# EAGLE design untitled (EAGLE 7.6.0)
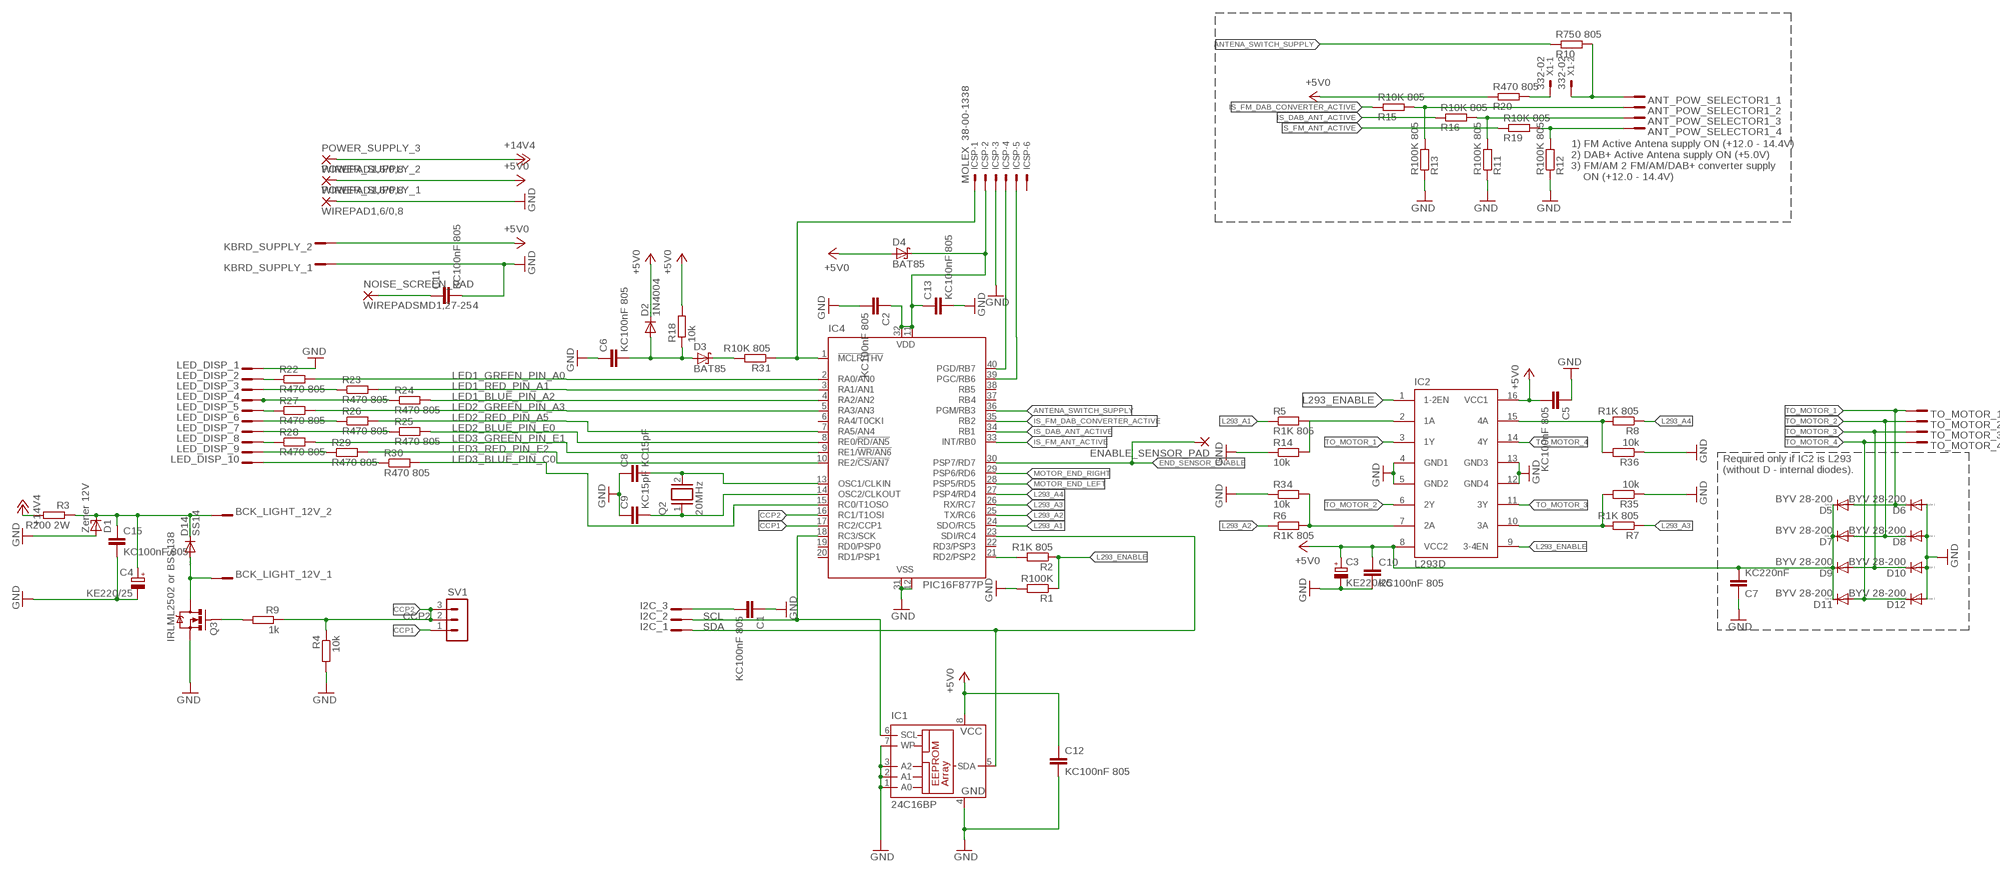
[diagram p0: schematic, sheet 1, part 1 of 2]
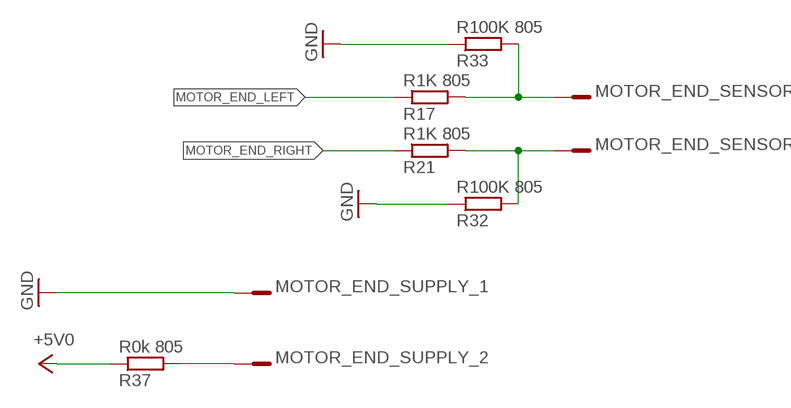
[diagram p1: schematic, sheet 1, part 2 of 2]

## Parts
ANT_POW_SELECTOR1  JST_4_PIN_B4B-PH-KS  [B4B-PH-KS]
BCK_LIGHT_12V  JST_2_PIN_B2B-XH-A  [B2B-XH-A]
C1  KC100nF 805  C-EUC0805  [C0805]
C2  KC100nF 805  C-EUC0805  [C0805]
C3  KE220/25  CPOL-EUE3.5-8  [E3,5-8]
C4  KE220/25  CPOL-EUTT2D7  [TT2D7]
C5  KC100nF 805  C-EUC0805  [C0805]
C6  KC100nF 805  C-EUC0805  [C0805]
C7  KC220nF  C-EU050-030X075  [C050-030X075]
C8  KC15pF  C-EU025-030X050  [C025-030X050]
C9  KC15pF  C-EU025-030X050  [C025-030X050]
C10  KC100nF 805  C-EUC0805  [C0805]
C11  KC100nF 805  C-EUC0805  [C0805]
C12  KC100nF 805  C-EUC0805  [C0805]
C13  KC100nF 805  C-EUC0805  [C0805]
C15  KC100nF 805  C-EUC0805  [C0805]
D1  Zener 12V  ZENER-DIODEZD-5  [ZDIO-5]
D2  1N4004  1N4004DO41-7.6  [DO41-7.6]
D3  BAT85  BAT85DO34-5  [DO34-5]
D4  BAT85  BAT85DO34-5  [DO34-5]
D5  BYV 28-200  BYV28  [SOD64-10]
D6  BYV 28-200  BYV28  [SOD64-10]
D7  BYV 28-200  BYV28  [SOD64-10]
D8  BYV 28-200  BYV28  [SOD64-10]
D9  BYV 28-200  BYV28  [SOD64-10]
D10  BYV 28-200  BYV28  [SOD64-10]
D11  BYV 28-200  BYV28  [SOD64-10]
D12  BYV 28-200  BYV28  [SOD64-10]
D14  SS14  DIODE-SMB  [SMB]
ENABLE_SENSOR_PAD  SMD2  [SMD1,27-2,54]
I2C  JST_3_PIN_B3B-PH-KS  [B3B-PH-KS]
IC1  24C16BP  [DIL8]
IC2  L293D  [DIL16]
IC4  PIC16F877P  [DIL40]
ICSP  MOLEX 38-00-1338  22-27-2061-06  [6410-06]
KBRD_SUPPLY  JST_2_PIN_B2B-PH-KS  [B2B-PH-KS]
LED_DISP  JST_10_PIN_B10B-PH-KS  [B10B-PH-KS]
MOTOR_END_SENSOR  JST_2_PIN_B2B-PH-KS  [B2B-PH-KS]
MOTOR_END_SUPPLY  JST_2_PIN_B2B-PH-KS  [B2B-PH-KS]
NOISE_SCREEN_PAD  WIREPADSMD1,27-254  [SMD1,27-2,54]
POWER_SUPPLY_1  WIREPAD1,6/0,8  [1,6/0,8]
POWER_SUPPLY_2  WIREPAD1,6/0,8  [1,6/0,8]
POWER_SUPPLY_3  WIREPAD1,6/0,8  [1,6/0,8]
Q2  20MHz  XTAL/S  [QS]
Q3  IRLML2502 or BSS138  MOSFET-NCHANNELSMD  [SOT23-3]
R1  R100K  R-EU_0204/7  [0204/7]
R2  R1K 805  R-EU_R0805  [R0805]
R3  R200 2W  R-EU_0207/12  [0207/12]
R4  10k  R-EU_M0805  [M0805]
R5  R1K 805  R-EU_R0805  [R0805]
R6  R1K 805  R-EU_R0805  [R0805]
R7  R1K 805  R-EU_R0805  [R0805]
R8  R1K 805  R-EU_R0805  [R0805]
R9  1k  R-EU_0207/12  [0207/12]
R10  R750 805  R-EU_R0805  [R0805]
R11  R100K 805  R-EU_R0805  [R0805]
R12  R100K 805  R-EU_R0805  [R0805]
R13  R100K 805  R-EU_R0805  [R0805]
R14  10k  R-EU_0204/2V  [0204V]
R15  R10K 805  R-EU_R0805  [R0805]
R16  R10K 805  R-EU_R0805  [R0805]
R17  R1K 805  R-EU_R0805  [R0805]
R18  10k  R-EU_R0805  [R0805]
R19  R10K 805  R-EU_R0805  [R0805]
R20  R470 805  R-EU_R0805  [R0805]
R21  R1K 805  R-EU_R0805  [R0805]
R22  R470 805  R-EU_R0805  [R0805]
R23  R470 805  R-EU_R0805  [R0805]
R24  R470 805  R-EU_R0805  [R0805]
R25  R470 805  R-EU_R0805  [R0805]
R26  R470 805  R-EU_R0805  [R0805]
R27  R470 805  R-EU_R0805  [R0805]
R28  R470 805  R-EU_R0805  [R0805]
R29  R470 805  R-EU_R0805  [R0805]
R30  R470 805  R-EU_R0805  [R0805]
R31  R10K 805  R-EU_R0805  [R0805]
R32  R100K 805  R-EU_R0805  [R0805]
R33  R100K 805  R-EU_R0805  [R0805]
R34  10k  R-EU_0204/5  [0204/5]
R35  10k  R-EU_0204/7  [0204/7]
R36  10k  R-EU_0204/7  [0204/7]
R37  R0k 805  R-EU_R0805  [R0805]
SV1  MA03-1  [MA03-1]
TO_MOTOR  JST_4_PIN_B4B-XH-A  [B4B-XH-A]
X1  332-02  [332-02]

## Nets
+5V: C3.+ C5.2 C7.2 C10.1 C12.1 D2.C D4.A D5.C D7.C D9.C D11.C IC1.8(VCC) IC2.8(VCC2) IC2.16(VCC1) KBRD_SUPPLY.P$2 POWER_SUPPLY_2.1(P) R18.2 R20.1 R37.1 ; supply symbol labelled +5V0
+14V4: POWER_SUPPLY_3.1(P) R3.2
ANTENA_SWITCH_SUPPLY: IC4.36(PGM/RB3) R10.1
CCP1: IC4.17(RC2/CCP1) SV1.1
CCP2: IC4.16(RC1/T1OSI) R4.1 R9.1 SV1.2 SV1.3
END_SENSOR_ENABLE: ENABLE_SENSOR_PAD.1(P) IC4.30(PSP7/RD7)
GND: C1.1 C2.2 C3.- C4.- C5.1 C6.1 C7.1 C8.1 C9.1 C10.2 C11.2 C12.2 C13.2 C15.2 D1.A D6.A D8.A D10.A D12.A IC1.1(A0) IC1.2(A1) IC1.3(A2) IC1.4(GND) IC1.7(WP) IC2.4(GND1) IC2.5(GND2) IC2.12(GND4) IC2.13(GND3) IC4.12(VSS) IC4.31(VSS) ICSP.3 KBRD_SUPPLY.P$1 LED_DISP.P$1 MOTOR_END_SUPPLY.P$1 POWER_SUPPLY_1.1(P) Q3.2(S) R1.2 R4.2 R11.1 R12.1 R13.1 R14.1 R32.1 R33.1 R34.1 R35.1 R36.1
IS_DAB_ANT_ACTIVE: IC4.34(RB1) R16.1
IS_FM_ANT_ACTIVE: IC4.33(INT/RB0) R19.1
IS_FM_DAB_CONVERTER_ACTIVE: IC4.35(RB2) R15.1
L293_A1: IC4.24(SDO/RC5) R5.1
L293_A2: IC4.25(TX/RC6) R6.1
L293_A3: IC4.26(RX/RC7) R7.1
L293_A4: IC4.27(PSP4/RD4) R8.1
L293_ENABLE: IC2.1(1-2EN) IC2.9(3-4EN) R1.1 R2.1
LED1_BLUE_PIN_A2: IC4.4(RA2/AN2) R24.2
LED1_GREEN: LED_DISP.P$3 R23.1
LED1_GREEN_PIN_A0: IC4.2(RA0/AN0) R22.2
LED1_RED: LED_DISP.P$4 R24.1
LED1_RED_PIN_A1: IC4.3(RA1/AN1) R23.2
LED2_BLUE: LED_DISP.P$5 R27.1
LED2_BLUE_PIN_E0: IC4.8(RE0/!RD/AN5) R25.2
LED2_GREEN: LED_DISP.P$6 R26.1
LED2_GREEN_PIN_A3: IC4.5(RA3/AN3) R27.2
LED2_RED: LED_DISP.P$7 R25.1
LED2_RED_PIN_A5: IC4.7(RA5/AN4) R26.2
LED3_BLUE: LED_DISP.P$8 R28.1
LED3_BLUE_PIN_C0: IC4.15(RC0/T1OSO) R30.2
LED3_GREEN: LED_DISP.P$9 R29.1
LED3_GREEN_PIN_E1: IC4.9(RE1/!WR/AN6) R28.2
LED3_RED: LED_DISP.P$10 R30.1
LED3_RED_PIN_E2: IC4.10(RE2/!CS/AN7) R29.2
MOTOR_END_LEFT: IC4.28(PSP5/RD5) R17.1
MOTOR_END_RIGHT: IC4.29(PSP6/RD6) R21.1
N$1: MOTOR_END_SUPPLY.P$2 R37.2
N$2: Q3.1(G) R9.2
N$3: BCK_LIGHT_12V.P$1 D14.A Q3.3(D)
N$4: R20.2 X1.1
N$5: IC2.2(1A) R5.2 R14.2
N$6: IC2.7(2A) R6.2 R34.2
N$8: IC2.15(4A) R8.2 R36.2
N$9: C8.2 IC4.13(OSC1/CLKIN) Q2.2
N$12: C1.2 I2C.P$3
N$14: MOTOR_END_SENSOR.P$2 R17.2 R33.2
N$15: MOTOR_END_SENSOR.P$1 R21.2 R32.2
N$22: C9.2 IC4.14(OSC2/CLKOUT) Q2.1
N$23: BCK_LIGHT_12V.P$2 C4.+ C15.1 D1.C D14.C R3.1
N$28: IC2.10(3A) R7.2 R35.2
N$32: ANT_POW_SELECTOR1.P$1 R10.2 X1.2
N$33: IC4.21(RD2/PSP2) R2.2
N$37: LED_DISP.P$2 R22.1
N$41: C2.1 C13.1 D4.C IC4.11(VDD) IC4.32(VDD) ICSP.2
N$49: C6.2 D2.A D3.A R18.1
N$53: D3.C R31.2
N$56: IC4.1(!MCLR/THV) ICSP.1 R31.1
NOISE_SCREEN: C11.1 NOISE_SCREEN_PAD.1(P)
PGC: IC4.39(PGC/RB6) ICSP.5
PGD: IC4.40(PGD/RB7) ICSP.4
SCL: I2C.P$2 IC1.6(SCL) IC4.18(RC3/SCK)
SDA: I2C.P$1 IC1.5(SDA) IC4.23(SDI/RC4)
SWITCH_1: ANT_POW_SELECTOR1.P$4 R12.2 R19.2
SWITCH_2: ANT_POW_SELECTOR1.P$3 R11.2 R16.2
SWITCH_3: ANT_POW_SELECTOR1.P$2 R13.2 R15.2
TO_MOTOR_1: D5.A D6.C IC2.3(1Y) TO_MOTOR.P$1
TO_MOTOR_2: D7.A D8.C IC2.6(2Y) TO_MOTOR.P$2
TO_MOTOR_3: D9.A D10.C IC2.11(3Y) TO_MOTOR.P$3
TO_MOTOR_4: D11.A D12.C IC2.14(4Y) TO_MOTOR.P$4
Unconnected: IC4.6(RA4/T0CKI) IC4.19(RD0/PSP0) IC4.20(RD1/PSP1) IC4.22(RD3/PSP3) IC4.37(RB4) IC4.38(RB5) ICSP.6

## Notes on the sheet
- 1) FM Active Antena supply ON (+12.0 - 14.4V)
  2) DAB+ Active Antena supply ON (+5.0V)
  3) FM/AM 2 FM/AM/DAB+ converter supply
      ON (+12.0 - 14.4V)
- Required only if IC2 is L293
  (without D - internal diodes).

## Library data of the parts
ANT_POW_SELECTOR1 TO_MOTOR = conn-JST:JST_4_PIN_
BCK_LIGHT_12V KBRD_SUPPLY MOTOR_END_SENSOR MOTOR_END_SUPPLY = conn-JST:JST_2_PIN_
C1 C2 C5-C13 C15 = rcl:C-EU: CAPACITOR, European symbol
C3 C4 = rcl:CPOL-EU: POLARIZED CAPACITOR, European symbol
D1 = diode:ZENER-DIODE: Z-Diode
D2 = diode_SileliS:1N4004: DIODE general purpose rectifier, 1 A
D3 D4 = diode_SileliS:BAT85
D5-D12 = diode:BYV28: DIODE ultra fast
D14 = diode:DIODE-: DIODE
ENABLE_SENSOR_PAD = wirepad:SMD2: SMD PAD
I2C = conn-JST:JST_3_PIN_
IC1 = microchip:24*: Serial EEPROM I2C; MPN: AT24C16B-PU; OC_FARNELL: 1362650; OC_NEWARK: 50M3323
IC2 = st-microelectronics:L293D: PUSH-PULL 4 CHANNEL DRIVER; MPN: L293D; OC_FARNELL: 9589619; OC_NEWARK: 56P8249
IC4 = microchip:PIC16F87*: MICROCONTROLLER; MF: MICROCHIP; MPN: PIC16F877-04/P; OC_FARNELL: 9761349; OC_NEWARK: 61K3463
ICSP = con-molex:22-?-06: CONNECTOR wire to board 2.54 mm (.1 inch) pitch header; OC_FARNELL: unknown; OC_NEWARK: unknown
LED_DISP = conn-JST:JST_10_PIN_
NOISE_SCREEN_PAD POWER_SUPPLY_1-POWER_SUPPLY_3 = wirepad:WIREPAD: Wire PAD connect wire on PCB
Q2 = special:XTAL/S: CRYSTAL
Q3 = SparkFun:MOSFET-NCHANNEL
R1 R2 R5-R8 R10-R37 = resistor:R-EU_: RESISTOR, European symbol
R3 R4 R9 = rcl:R-EU_: RESISTOR, European symbol
SV1 = con-lstb:MA03-1: PIN HEADER; OC_FARNELL: unknown; OC_NEWARK: unknown
X1 = con-garry:332-02: 2 Pin - 2mm Dual Row Source: www.mpe-connector.de / garry_shortform_2012.pdf

## Net classes
1 VCC: width 0.6 mm, clearance 0.6 mm

## Board
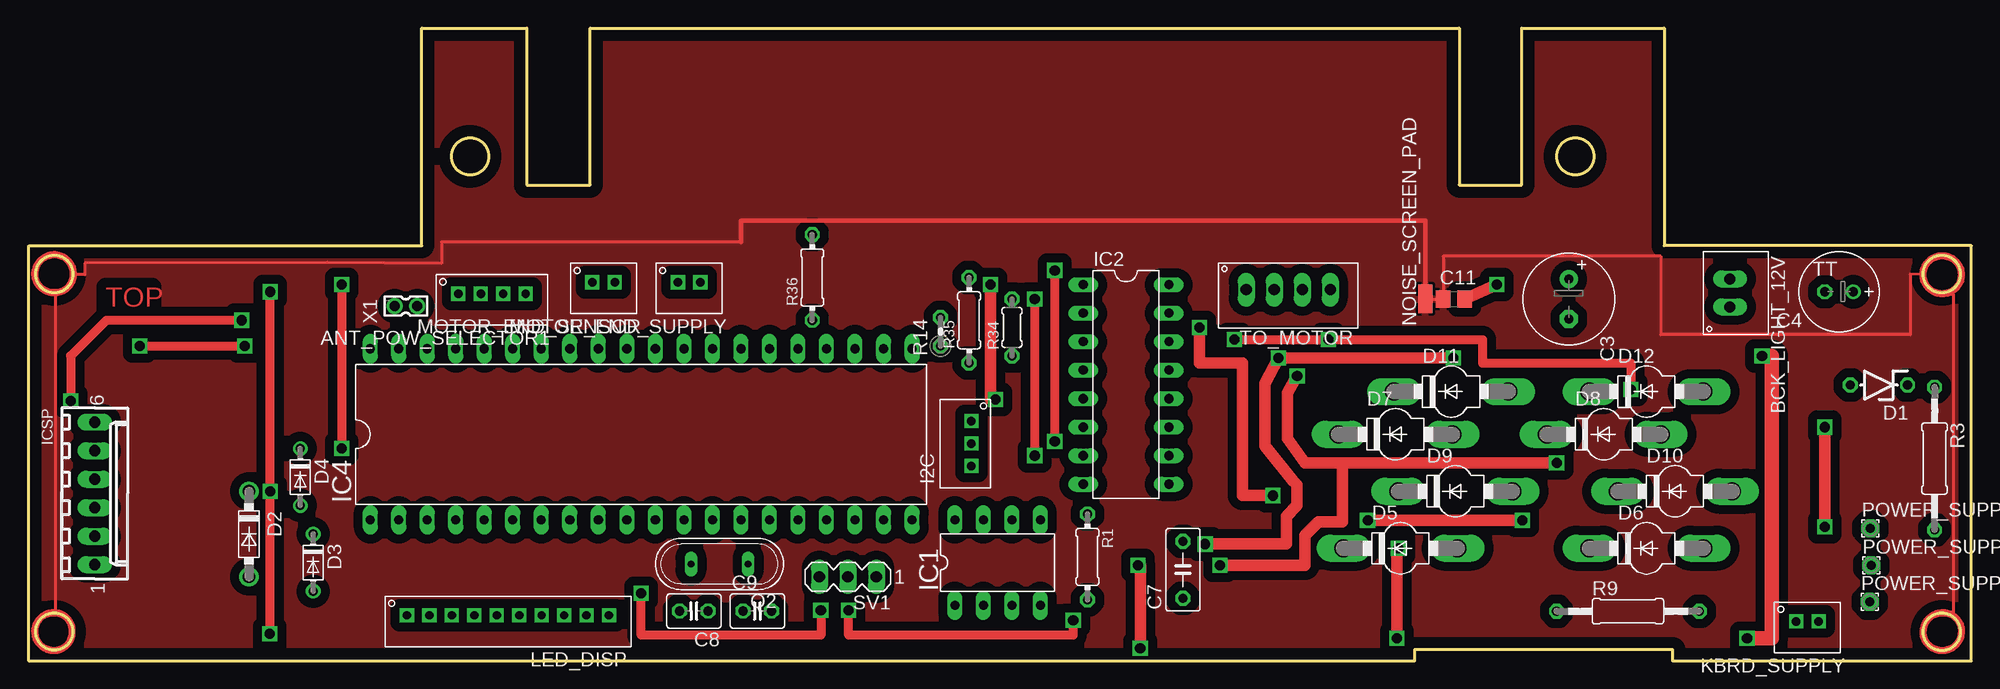
[diagram p2: board, top side]
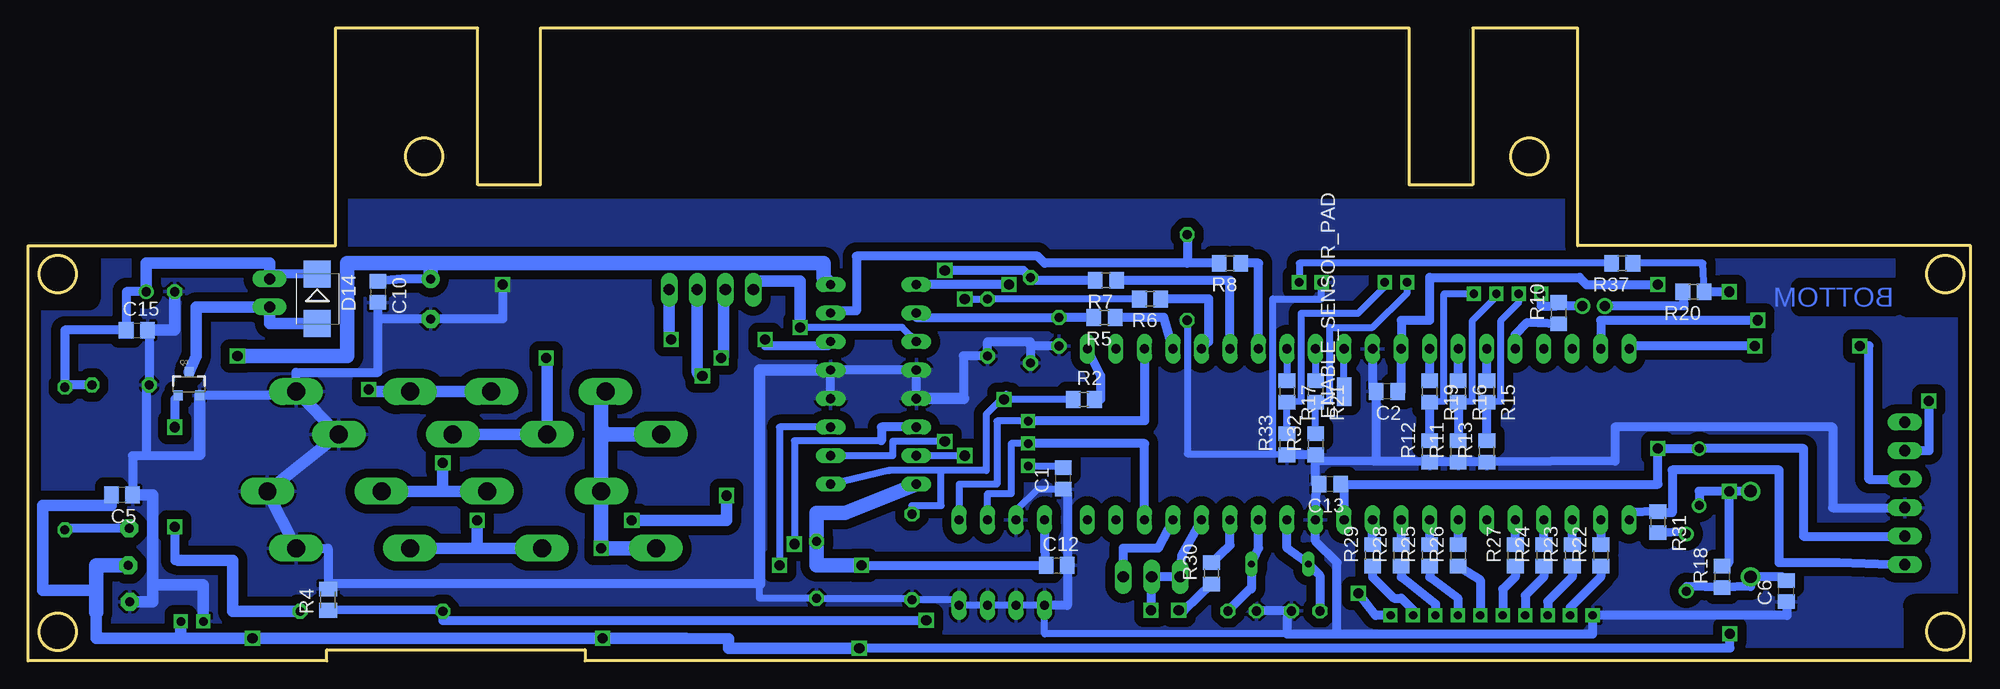
[diagram p3: board, bottom side, seen from below]

Size 173 x 56.38 mm. Coordinates in mm from the lower left corner, seen from the top.
Outline: 0,0 0,37 35,37 35,56.38 44.35,56.38 44.35,42.39 50,42.39 50,56.38 127.38,56.38 127.38,42.39 132.95,42.39 132.95,56.38 145.65,56.38 145.65,37 173,37 173,0 146.4,0 146.4,1 123.4,1 123.4,0 0,0
Outline: circle at 39.29,44.95 radius 1.65
Outline: circle at 137.72,44.95 radius 1.65
Outline: circle at 170.38,34.47 radius 1.65
Outline: circle at 170.38,2.6 radius 1.65
Outline: circle at 2.26,2.61 radius 1.65
Outline: circle at 2.26,34.47 radius 1.65
Copper layers (1*16): Top 0.035mm / dielectric 1.5mm / Bottom 0.035mm
Design rules "default": minimum track width 10mil, minimum drill 24mil, track to track 8mil, track to pad 8mil, pad to pad 8mil, via to via 8mil, smd to smd 8mil, copper to edge 40mil, drill to drill 8mil, minimum pad ring 10mil, minimum via ring 8mil, stop-mask expansion 4mil, vias tented up to drill 0mil, thermal gap 10mil
bRestrict: 16 lines

### Footprints (pad centres in the part's own frame; a part is rotated, then mirrored left to right if it is on the bottom)
B4B-PH-KS = drill 0.75 pad 1.2 square: P$1 -2,1.7; P$2 -4,1.7; P$3 -6,1.7; P$4 -8,1.7
B2B-XH-A = drill 1 long: P$1 -2.45,2.35; P$2 -4.95,2.35
C0805 = smd 1.3 x 1.5: 1 -0.95,0; 2 0.95,0
E3,5-8 = drill 0.813 pad 1.6: + -1.778,0 | drill 0.813 pad 1.6 octagon: - 1.778,0
TT2D7 = drill 0.813: + -1.27,0 | drill 0.813 octagon: - 1.27,0
C050-030X075 = drill 0.813 octagon: 1 -2.54,0; 2 2.54,0
C025-030X050 = drill 0.813 octagon: 1 -1.27,0; 2 1.27,0
ZDIO-5 = drill 0.813 octagon: A 2.54,0; C -2.54,0
DO41-7.6 = drill 1.1 pad 1.7: A 3.81,0; C -3.81,0
DO34-5 = drill 0.8: A 2.54,0; C -2.54,0
SOD64-10 = drill 1.6 long: A 5.08,0; C -5.08,0
SMB = smd 2.4 x 2.4: A 2.2,0; C -2.2,0
SMD1,27-2,54 = smd 1.27 x 2.54: 1 0,0
B3B-PH-KS = drill 0.75 pad 1.2 square: P$1 -2,1.7; P$2 -4,1.7; P$3 -6,1.7
DIL8 = drill 0.813 long: 1 -3.81,-3.81; 2 -1.27,-3.81; 3 1.27,-3.81; 4 3.81,-3.81; 5 3.81,3.81; 6 1.27,3.81; 7 -1.27,3.81; 8 -3.81,3.81
DIL16 = drill 0.813 long: 1 -8.89,-3.81; 2 -6.35,-3.81; 3 -3.81,-3.81; 4 -1.27,-3.81; 5 1.27,-3.81; 6 3.81,-3.81; 7 6.35,-3.81; 8 8.89,-3.81; 9 8.89,3.81; 10 6.35,3.81; 11 3.81,3.81; 12 1.27,3.81; 13 -1.27,3.81; 14 -3.81,3.81; 15 -6.35,3.81; 16 -8.89,3.81
DIL40 = drill 0.813 long: 1 -24.13,-7.62; 2 -21.59,-7.62; 3 -19.05,-7.62; 4 -16.51,-7.62; 5 -13.97,-7.62; 6 -11.43,-7.62; 7 -8.89,-7.62; 8 -6.35,-7.62; 9 -3.81,-7.62; 10 -1.27,-7.62; 11 1.27,-7.62; 12 3.81,-7.62; 13 6.35,-7.62; 14 8.89,-7.62; 15 11.43,-7.62; 16 13.97,-7.62; 17 16.51,-7.62; 18 19.05,-7.62; 19 21.59,-7.62; 20 24.13,-7.62; 21 24.13,7.62; 22 21.59,7.62; 23 19.05,7.62; 24 16.51,7.62; 25 13.97,7.62; 26 11.43,7.62; 27 8.89,7.62; 28 6.35,7.62; 29 3.81,7.62; 30 1.27,7.62; 31 -1.27,7.62; 32 -3.81,7.62; 33 -6.35,7.62; 34 -8.89,7.62; 35 -11.43,7.62; 36 -13.97,7.62; 37 -16.51,7.62; 38 -19.05,7.62; 39 -21.59,7.62; 40 -24.13,7.62
6410-06 = drill 1.016 long: 1 6.35,0; 2 3.81,0; 3 1.27,0; 4 -1.27,0; 5 -3.81,0; 6 -6.35,0
B2B-PH-KS = drill 0.75 pad 1.2 square: P$1 -2,1.7; P$2 -4,1.7
B10B-PH-KS = drill 0.75 pad 1.2 square: P$1 -2,1.7; P$2 -4,1.7; P$3 -6,1.7; P$4 -8,1.7; P$5 -10,1.7; P$6 -12,1.7; P$7 -14,1.7; P$8 -16,1.7; P$9 -18,1.7; P$10 -20,1.7
1,6/0,8 = drill 0.813 pad 1.6 octagon: 1 0,0
QS = drill 0.61 long: 1 -2.54,0; 2 2.54,0
SOT23-3 = smd 0.8 x 0.9: 1 -0.95,-1; 2 0.95,-1; 3 0,1.1
0204/7 = drill 0.813 octagon: 1 -3.81,0; 2 3.81,0
R0805 = smd 1.3 x 1.5: 1 -0.95,0; 2 0.95,0
0207/12 = drill 0.813 octagon: 1 -6.35,0; 2 6.35,0
M0805 = smd 1.3 x 1.6: 1 -0.95,0; 2 0.95,0
0204V = drill 0.813 octagon: 1 -1.27,0; 2 1.27,0
0204/5 = drill 0.813 octagon: 1 -2.54,0; 2 2.54,0
MA03-1 = drill 1.016 long: 1 -2.54,0; 2 0,0; 3 2.54,0
B4B-XH-A = drill 1 long: P$1 -2.45,2.35; P$2 -4.95,2.35; P$3 -7.45,2.35; P$4 -9.95,2.35
332-02 = drill 0.9 pad 1.27: 1 0,-1; 2 0,1

### Placement (x,y rotation side)
ANT_POW_SELECTOR1  36.24,34.41 180 top
BCK_LIGHT_12V  149.15,29.07 270 top
C1  80.82,16.25 90 bottom
C2  51.99,24 180 bottom
C3  137.14,32.25 270 top
C4  161.21,32.88 180 top
C5  164.64,14.79 180 bottom
C6  16.43,6.21 90 bottom
C7  102.79,8.12 90 top
C8  59.23,4.44 180 top
C9  64.88,4.44 0 top
C10  141.84,32.88 270 bottom
C11  126.92,32.25 0 top
C12  81.39,8.5 0 bottom
C13  57.07,15.74 180 bottom
C15  163.31,29.46 0 bottom
D1  164.77,24.57 180 top
D2  19.61,11.29 270 top
D3  25.32,8.76 270 top
D4  24.18,16.38 270 top
D5  122.16,10.03 0 top
D6  144.06,10.03 0 top
D7  121.71,20.18 0 top
D8  140.25,20.18 0 top
D9  127.05,15.11 0 top
D10  146.6,15.11 0 top
D11  126.67,24 0 top
D12  144.06,24 0 top
D14  147.24,32.25 270 bottom
ENABLE_SENSOR_PAD  55.8,24 0 bottom
I2C  85.64,23.36 90 top
IC1  86.28,8.76 0 top
IC2  97.71,24.63 270 top
IC4  54.53,20.18 0 top
ICSP  5.87,14.91 270 top
KBRD_SUPPLY  155.39,5.21 180 top
LED_DISP  31.67,5.76 180 top
MOTOR_END_SENSOR  48.18,35.42 180 top
MOTOR_END_SUPPLY  55.8,35.42 180 top
NOISE_SCREEN_PAD  124.38,32.25 0 top
POWER_SUPPLY_1  163.94,5.26 0 top
POWER_SUPPLY_2  164.07,8.5 0 top
POWER_SUPPLY_3  164,11.8 0 top
Q2  61.52,8.63 180 top
Q3  158.67,24.63 0 bottom
R1  94.28,9.26 270 top
R2  78.98,23.3 0 bottom
R3  169.72,18.03 270 top
R4  146.29,5.45 90 bottom
R5  77.14,30.6 180 bottom
R6  73.07,32.25 180 bottom
R7  77.01,33.9 180 bottom
R8  65.96,35.42 180 bottom
R9  142.41,4.42 0 top
R10  36.7,30.98 90 bottom
R11  45.64,18.66 90 bottom
R12  48.18,18.66 90 bottom
R13  43.1,18.66 90 bottom
R14  81.2,29.33 90 top
R15  43.1,24 270 bottom
R16  45.64,24 270 bottom
R17  60.88,24 270 bottom
R18  22.14,7.49 90 bottom
R19  48.18,24 270 bottom
R20  24.68,32.88 180 bottom
R21  58.34,24 270 bottom
R22  32.94,9.39 90 bottom
R23  35.48,9.39 90 bottom
R24  38.02,9.39 90 bottom
R25  48.18,9.39 90 bottom
R26  45.64,9.39 90 bottom
R27  40.56,9.39 90 bottom
R28  50.72,9.39 90 bottom
R29  53.26,9.39 90 bottom
R30  67.61,7.8 90 bottom
R31  27.86,12.36 270 bottom
R32  58.34,19.3 90 bottom
R33  60.88,19.3 90 bottom
R34  87.55,29.71 90 top
R35  83.74,30.34 90 top
R36  69.77,34.16 90 top
R37  31.04,35.42 180 bottom
SV1  72.94,7.49 180 top
TO_MOTOR  105.97,35.42 180 top
X1  33.58,31.61 270 top

### Tracks (layer width: path | path; a pad name or v marks a point on that pad's centre or on a via)
+5V  (via drill 0.9)
  Top 0.813: v21.51,32.88 v21.51,15.11 21.51,2.41 v21.45,2.41
  Top 1.016: v98.79,8.5 98.98,8.5 v98.98,1.14 | v121.97,10.03 121.84,10.03 v121.84,2.01
  Top 1.27: v154.35,27.17 155.24,27.17 155.24,2.01 v153.02,2.01
  Bottom 0.61: R20.1 23.84,35.42 R37.1
  Bottom 0.813: v21.45,2.41 21.45,1.14 v98.98,1.14 | R20.1 v21.51,32.88 | R18.2 arc-90 21.51,8.97 v21.51,15.11 D2.C 24.18,15.11 D4.A | IC1.8 82.47,9.84 C12.1 v98.79,8.5 | C3.+ 139.62,34.03 C10.1
  Bottom 1.016: 159.39,2.01 v153.02,2.01 v121.84,2.01 114.41,2.01 110.6,1.96 110.6,1.14 v98.98,1.14 | KBRD_SUPPLY.P$2 159.39,2.01 | 159.39,2.01 166.95,2.01 166.93,4.31 | C5.2 165.59,13.84 171.69,13.84 171.69,6.28 166.93,6.28
  Bottom 1.27: IC2.16 102.16,34.16 102.16,35.42 137.14,35.42 | 166.93,4.31 166.93,6.28 166.93,8.5 POWER_SUPPLY_2.1 | IC2.8 100.25,13.2 102.79,13.2 C7.2 102.79,8.5 v98.79,8.5 | C3.+ 137.14,35.42 | 137.14,35.42 144.57,35.42 144.57,27.17 v154.35,27.17 | D11.C 121.97,24 121.97,20.82 | 121.97,20.82 D9.C v121.97,10.03 D5.C | D7.C 121.33,20.18 arc90 121.97,20.82
+14V4
  Bottom 0.813: POWER_SUPPLY_3.1 169.72,11.8 R3.2
ANTENA_SWITCH_SUPPLY
  Bottom 0.813: R10.1 39.51,30.13 40.56,29.07 IC4.36
CCP1
  Bottom 0.813: IC4.17 72.37,10.03 75.48,10.03 SV1.1
CCP2  (via drill 0.9)
  Top 0.813: v93.01,3.61 93.01,2.28 73.01,2.28 v73.01,4.5
  Bottom 0.813: IC4.16 70.28,9.39 SV1.3 73.01,7.49 | v93.01,3.61 136.06,3.61 R9.1 136.06,4.56 R4.1 | 73.01,7.49 v73.01,4.5 | SV1.2 73.01,7.49
END_SENSOR_ENABLE
  Bottom 0.61: ENABLE_SENSOR_PAD.1 IC4.30
GND  (via drill 0.9)
  Top 1.016: C11.2 v130.73,33.52
  Bottom 0.61: 60.88,2.41 82.47,2.41 IC1.1 IC1.2 | IC1.2 IC1.3 IC1.4 90.09,5.45 R1.2 94.28,5.58 C7.1 107.87,5.58 107.87,6.85 | C1.1 83.1,15.3 85.01,13.39 IC1.7 | 84.69,4.95 IC1.2 | R36.1 69.77,18.45 62.15,18.45 | 62.15,18.45 R33.1 | MOTOR_END_SUPPLY.P$1 57.8,32.25 62.15,32.25 62.15,18.45
  Bottom 0.813: C6.1 16.37,4.06 LED_DISP.P$1 33.67,2.41 56.44,2.41 | 56.44,2.41 60.88,2.41 60.88,4.44 C8.1 C9.1 | 56.44,2.41 56.44,8.76 58.34,10.66 IC4.12 58.34,14.79 C13.2 58.34,15.74 R32.1 | IC2.5 IC2.4 IC2.13 IC2.12 | R32.1 R33.1 | R12.1 R11.1 R13.1 31.67,17.81 31.67,20.82 12.3,20.82 12.3,13.64 ICSP.3 | R12.1 58.34,17.81 R32.1 | 83.74,28.06 R35.1 | 83.74,28.06 83.74,28.44 87.55,28.44 R34.1 89.71,27.17 89.71,23.36 | R14.1 83.74,28.06 | R12.1 52.94,17.81 C2.2 53.26,24.32 IC4.31 | C5.1 163.69,18.28 162.48,18.28 | Q3.2 149.51,23.63 D12.A 149.15,25.7 141.84,25.7 141.84,30.47 | 157.72,18.41 157.72,18.28 162.48,18.28 | 107.87,6.85 146.29,6.85 R4.2 146.29,10.03 D6.A | C1.1 arc90 80.44,14.92 C12.2 80.44,4.95 IC1.1 | 159.94,29.46 162.23,29.46 D1.A 162.48,24.57 162.48,18.28 | v130.73,33.52 130.73,30.47 C3.- 141.84,30.47 | 141.84,30.47 C10.2
  Bottom 1.016: C4.- 159.94,29.46 C15.2 | 161.91,6.76 157.39,6.76 KBRD_SUPPLY.P$1 | C5.1 161.91,14.79 161.91,6.76 | D12.A D8.A D10.A D6.A | IC2.13 107.87,25.9 107.87,6.85 | Q3.2 157.72,18.41 | POWER_SUPPLY_1.1 161.91,5.26 161.91,6.76 | IC2.5 89.71,23.36
  pour Bottom (isolate 0.813): -1.35,-2.04 -1.7,41 174.83,41 175.18,-2.04
  pour Bottom (isolate 0.813, no thermals): 92.44,23.55 92.44,25.96 102.98,25.96 102.98,23.55
IS_DAB_ANT_ACTIVE
  Bottom 0.813: R16.1 IC4.34
IS_FM_ANT_ACTIVE
  Bottom 0.813: R19.1 IC4.33
IS_FM_DAB_CONVERTER_ACTIVE
  Bottom 0.813: R15.1 IC4.35
L293_A1
  Bottom 0.813: IC4.24 71.86,30.6 R5.1
L293_A2
  Bottom 0.813: IC4.25 67.87,28.44 67.87,32.25 R6.1
L293_A3
  Bottom 0.813: IC4.26 65.96,33.9 R7.1
L293_A4
  Bottom 0.813: IC4.27 63.42,35.42 R8.1
L293_ENABLE  (via drill 0.9)
  Top 1.016: v85.64,33.52 85.64,23.3 v86.09,23.3
  Bottom 0.61: 91.68,16.95 87.68,16.95 87.68,21.96 85.9,23.74 v86.09,23.3 R2.1 | 91.68,16.95 96.31,16.95 IC2.9 | 91.68,16.95 91.68,13.81 94.28,13.81 R1.1
  Bottom 0.813: v85.64,33.52 IC2.1
LED1_BLUE_PIN_A2
  Bottom 0.813: R24.2 IC4.4
LED1_GREEN
  Bottom 0.813: R23.1 35.48,7.49 37.67,5.29 LED_DISP.P$3
LED1_GREEN_PIN_A0
  Bottom 0.813: IC4.2 R22.2
LED1_RED
  Bottom 0.813: R24.1 38.02,7.49 39.67,5.83 LED_DISP.P$4
LED1_RED_PIN_A1
  Bottom 0.813: R23.2 IC4.3
LED2_BLUE
  Bottom 0.813: R27.1 40.56,7.49 41.67,6.38 LED_DISP.P$5
LED2_BLUE_PIN_E0
  Bottom 0.813: R25.2 IC4.8
LED2_GREEN
  Bottom 0.813: R26.1 43.67,7.21 LED_DISP.P$6
LED2_GREEN_PIN_A3
  Bottom 0.813: R27.2 IC4.5
LED2_RED
  Bottom 0.813: R25.1 48.18,7.49 45.67,5.61 LED_DISP.P$7
LED2_RED_PIN_A5
  Bottom 0.813: R26.2 IC4.7
LED3_BLUE
  Bottom 0.813: R28.1 50.72,7.49 47.67,5.07 LED_DISP.P$8
LED3_BLUE_PIN_C0
  Bottom 0.813: R30.2 65.96,10.3 IC4.15
LED3_GREEN
  Bottom 0.813: R29.1 53.26,7.49 51.35,5.58 50.72,5.58 49.67,4.53 LED_DISP.P$9
LED3_GREEN_PIN_E1
  Bottom 0.813: R28.2 IC4.9
LED3_RED  (via drill 0.9)
  Top 0.813: v70.53,4.5 70.53,2.28 54.53,2.28 v54.53,6.02
  Bottom 0.813: LED_DISP.P$10 53.01,4.06 v54.53,6.02 | R30.1 70.06,4.5 v70.53,4.5
LED3_RED_PIN_E2
  Bottom 0.813: R29.2 IC4.10
MOTOR_END_LEFT
  Bottom 0.61: IC4.28 R17.1
MOTOR_END_RIGHT
  Bottom 0.61: IC4.29 R21.1
N$1
  Bottom 0.61: R37.2 59.8,35.42 MOTOR_END_SUPPLY.P$2
N$2  (via drill 0.9)
  Top 1.016: v159.94,20.82 v159.94,11.93
  Bottom 0.813: Q3.1 159.94,23.31 v159.94,20.82 | v159.94,11.93 159.94,8.95 159.62,8.95
  Bottom 1.016: R9.2 154.8,4.42 154.8,8.95 159.62,8.95
N$3
  Bottom 1.016: D14.A 151.5,30.05 BCK_LIGHT_12V.P$1 158.03,31.52 158.03,27.17 Q3.3
N$4
  Bottom 0.813: R20.2 25.54,31.61 X1.1
N$5
  Bottom 0.813: IC2.2 93.9,30.6 R14.2 R5.2
N$6  (via drill 0.9)
  Top 0.813: v89.58,32.25 v89.58,18.28
  Bottom 0.61: v89.58,18.28 IC2.7 | R6.2 R34.2 v89.58,32.25
N$8
  Bottom 0.813: R8.2 69.77,35.42 | 69.77,35.42 82.47,35.42 83.11,36.06 99.23,36.06 99.23,31.17 101.52,31.17 IC2.15 | R36.2 69.77,35.42
N$9
  Bottom 0.813: IC4.13 60.88,10.03 Q2.2 57.96,7.61 C8.2
N$12
  Bottom 0.61: I2C.P$3 80.82,17.36 C1.2
N$14
  Bottom 0.61: R33.2 R17.2 59.61,23.14 59.61,30.98 54.53,30.98 52.18,33.33 MOTOR_END_SENSOR.P$2
N$15
  Bottom 0.61: R32.2 R21.2 57.07,23.14 57.07,29.71 53.26,29.71 50.18,32.79 MOTOR_END_SENSOR.P$1
N$22
  Bottom 0.813: IC4.14 63.42,10.03 Q2.1 64.06,6.41 64.18,6.41 C9.2
N$23
  Bottom 0.813: C4.+ 164.26,32.88 C15.1 169.72,29.46 R3.1 169.72,24.57 D1.C | D14.C 151.5,34.45 BCK_LIGHT_12V.P$2
  Bottom 1.016: C4.+ 162.48,35.42 151.5,35.42 BCK_LIGHT_12V.P$2
N$28  (via drill 0.9)
  Top 0.813: v91.36,34.79 v91.36,19.55
  Bottom 0.61: v91.36,19.55 96,19.55 96,18.28 IC2.10
  Bottom 0.813: R7.2 83.74,33.9 R35.2 84.38,34.79 v91.36,34.79
N$32
  Bottom 0.813: X1.2 36.91,31.61 | 38.24,31.61 36.91,31.61 | 36.91,31.61 arc-90 R10.2 | 38.27,31.61 38.24,31.61 | 38.24,31.61 ANT_POW_SELECTOR1.P$1
N$33
  Bottom 0.813: R2.2 77.45,23.3 77.45,25.39 IC4.21
N$37
  Bottom 0.813: R22.1 32.94,7.49 35.67,4.75 LED_DISP.P$2
N$41  (via drill 0.9)
  Top 0.813: v27.86,33.52 v27.86,18.91
  Bottom 0.813: IC4.11 55.8,15.42 C13.1 27.86,15.74 v27.86,18.91 D4.C 14.91,18.91 14.91,11.1 ICSP.2 | v27.86,33.52 34.21,33.52 34.84,34.16 48.18,34.16 48.18,30.34 50.72,30.34 IC4.32 50.72,24 C2.1
N$49
  Bottom 0.813: C6.2 16.75,7.49 D2.A 19.61,6.63 R18.1 25.32,6.63 D3.A
N$53
  Bottom 0.813: D3.C 25.32,11.51 R31.2
N$56
  Bottom 0.813: IC4.1 30.4,13.21 R31.1 27.86,13.2 26.59,13.2 26.59,17.01 17.06,17.01 17.06,8.76 11.73,8.76 ICSP.1
NOISE_SCREEN
  Top 0.254: 3.84,2.7 3.84,2.6 | 170.4,32.7 171.37,32.7 171.37,4.31 170.5,4.31 170.5,4.3 | 168.7,34.4 167.54,34.46 167.56,29.07 145.32,29.07 145.32,36.06 | 145.32,36.06 125.97,36.06 C11.1 NOISE_SCREEN_PAD.1 | 2.35,32.8 2.35,4.3 2.25,4.3 | 63.42,37.33 36.75,37.33 36.75,35.4 26.6,35.5 5,35.42 5,34.4 3.95,34.4 | 145.34,36.06 145.32,36.06
  Top 0.406: 63.42,37.33 63.42,39.23 124.38,39.23 NOISE_SCREEN_PAD.1
  Top 0.61: 2.35,36.2 arc-90 3.95,34.4 arc-90 2.35,32.8 arc-90 0.54,34.4 arc-90 2.25,36.2 | 3.84,2.7 arc90 2.25,4.3 arc93 0.54,2.6 arc90 2.25,0.9 arc90 3.84,2.6 | 170.4,36.1 arc-90 172.1,34.4 arc-90 170.4,32.7 arc-90 168.7,34.4 arc-90 170.4,36.1 | 170.5,4.3 arc-90 172.1,2.6 arc-90 170.4,0.9 arc-90 168.7,2.6 arc-90 170.5,4.3
  pour Top (isolate 0.813): -1.6,-3.68 176.2,-3.62 176.06,39.9 146.96,39.71 147.26,60.16 34.38,60.01 34.12,39.72 -1.44,39.66
PGC  (via drill 0.9)
  Top 0.813: v18.97,30.34 6.91,30.34 3.73,27.17 v3.73,23.17
  Bottom 0.813: IC4.39 32.94,30.34 v18.97,30.34 | v3.73,23.17 3.73,18.72 ICSP.5
PGD  (via drill 0.9)
  Top 0.813: v9.89,28.06 v19.22,28.06
  Bottom 0.813: ICSP.4 9.06,16.18 9.06,28.06 v9.89,28.06 | v19.22,28.06 30.4,28.06 IC4.40
SCL
  Bottom 0.61: IC1.6 87.55,14.91 85.45,14.91 85.45,19.36 I2C.P$2
  Bottom 0.813: IC4.18 73.58,19.36 I2C.P$2
SDA
  Bottom 0.61: I2C.P$1 86.72,21.36 86.72,15.74 90.09,15.74 IC1.5
  Bottom 0.813: I2C.P$1 83.94,21.39 73.58,21.39 IC4.23
SWITCH_1
  Bottom 0.61: R19.2 46.91,23.14 46.91,32.68 46.88,32.71 ANT_POW_SELECTOR1.P$4
  Bottom 0.813: R12.2 R19.2
SWITCH_2
  Bottom 0.61: R16.2 44.37,23.14 44.37,30.34 42.24,32.47 ANT_POW_SELECTOR1.P$3
  Bottom 0.813: R16.2 R11.2
SWITCH_3
  Bottom 0.61: R15.2 41.83,23.14 41.83,30.34 40.24,31.93 ANT_POW_SELECTOR1.P$2
  Bottom 0.813: R13.2 R15.2
TO_MOTOR_1  (via drill 0.9)
  Top 1.016: v119.24,12.5 v133.02,12.5 | v110.79,14.72 108.06,14.72 108.06,26.54 104.25,26.54 v104.25,29.71
  Bottom 0.61: v104.25,29.71 95.17,29.71 IC2.3
  Bottom 1.016: v104.25,29.71 104.25,33.84 108.42,33.84 TO_MOTOR.P$1 | D5.A 133.02,10.03 | 133.02,10.03 D6.C | v133.02,12.5 133.02,10.03 | v110.79,14.72 110.79,12.5 v119.24,12.5
TO_MOTOR_2  (via drill 0.9)
  Top 0.813: 112.95,15.68 arc90 112.63,15.99
  Top 1.016: v104.76,10.41 112,10.41 112,12.88 112.95,13.84 112.95,15.68 | 112.63,15.99 110.09,19.17 110.09,24.69 v111.3,26.98 v126.86,26.98
  Bottom 0.61: 97.01,19.61 104.76,19.61 v104.76,10.41
  Bottom 0.813: v111.3,26.98 111.05,27.17 | 111.05,32.44 110.92,32.44 TO_MOTOR.P$2 | 135.81,20.18 D8.C | IC2.6 97.01,20.82 97.01,19.61
  Bottom 1.016: 111.05,32.44 111.05,27.17 | D8.C D7.A 126.79,26.92 v126.86,26.98
TO_MOTOR_3  (via drill 0.9)
  Top 1.016: v112.95,25.39 112.08,23.86 112.08,19.81 113.65,17.64 117,17.64 | v106.09,8.5 113.65,8.5 113.65,11.17 114.86,12.37 117,12.37 117,17.64 | 117,17.64 v136.06,17.64
  Bottom 0.61: IC2.11 106.09,20.82 v106.09,8.5
  Bottom 0.813: 113.39,32.25 113.42,32.25 TO_MOTOR.P$3
  Bottom 1.016: D10.C 135.81,15.11 | 135.81,15.11 D9.A | v112.95,25.39 arc90 113.42,25.86 TO_MOTOR.P$3 | v136.06,17.64 136.06,15.36 arc-90 135.81,15.11
TO_MOTOR_4  (via drill 0.9)
  Top 0.813: v107.36,28.63 v115.74,28.63 129.46,28.63 129.46,26.54 142.67,26.54 v142.67,24.19
  Bottom 0.813: IC2.14 101.77,28.19 101.77,28.06 107.36,28.06 v107.36,28.63 | 115.92,29.07 v115.74,28.63
  Bottom 1.016: D11.A D12.C 142.68,24 v142.67,24.19 | TO_MOTOR.P$4 115.92,29.07

### Text on the board
Top: TOP
Bottom: BOTTOM